# EAGLE design S202E (EAGLE 6.6.0)
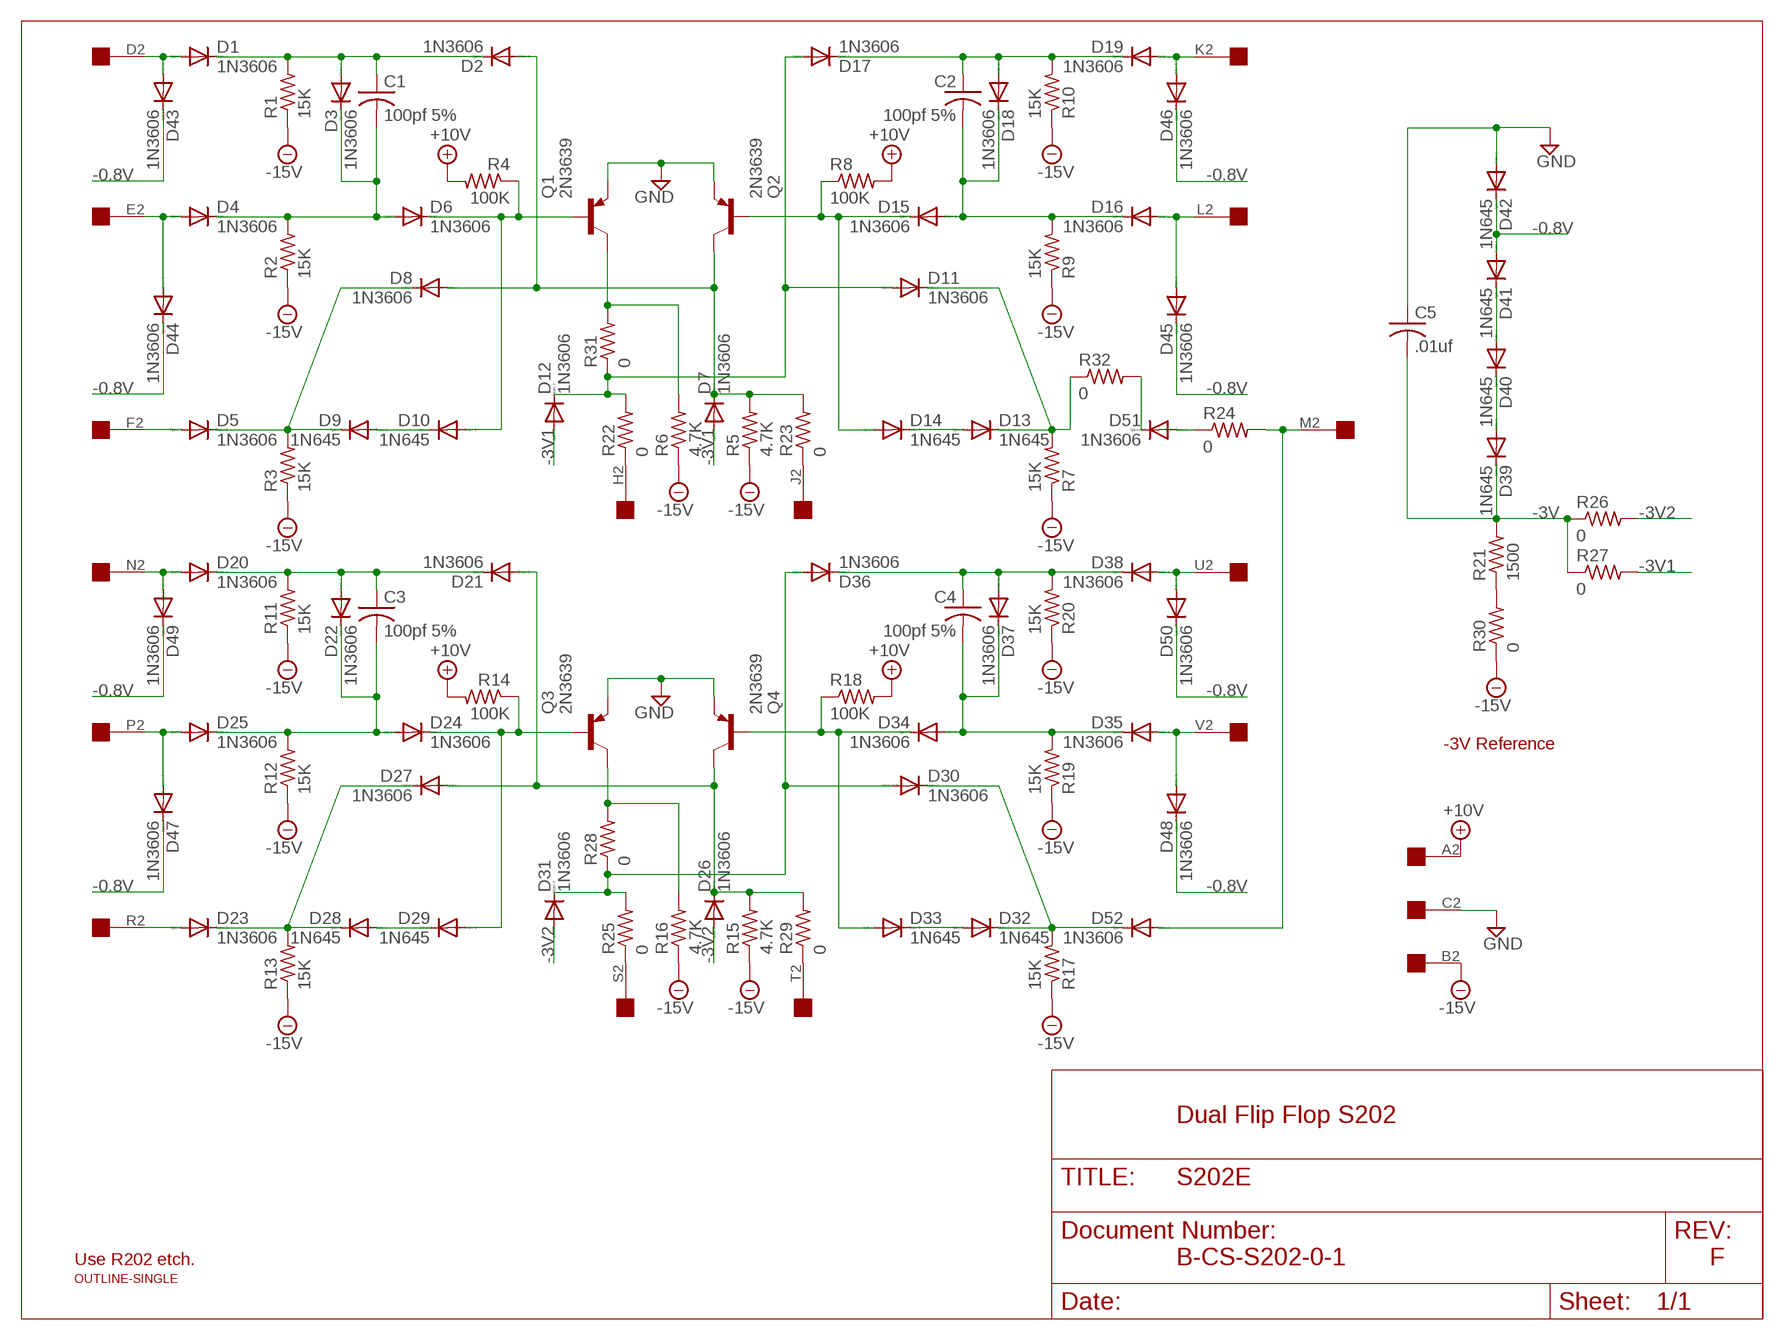
[diagram p0: schematic, sheet 1]

## Parts
C1  100pf 5%  C-US  [C063-025X075]
C2  100pf 5%  C-US  [C063-025X075]
C3  100pf 5%  C-US  [C063-025X075]
C4  100pf 5%  C-US  [C063-025X075]
C5  .01uf  C-US  [C063-025X075]
D1  1N3606  1N4148DO35-10  [DO35-10]
D2  1N3606  1N4148DO35-10  [DO35-10]
D3  1N3606  1N4148DO35-10  [DO35-10]
D4  1N3606  1N4148DO35-10  [DO35-10]
D5  1N3606  1N4148DO35-10  [DO35-10]
D6  1N3606  1N4148DO35-10  [DO35-10]
D7  1N3606  1N4148DO35-10  [DO35-10]
D8  1N3606  1N4148DO35-10  [DO35-10]
D9  1N645  1N4148DO35-10  [DO35-10]
D10  1N645  1N4148DO35-10  [DO35-10]
D11  1N3606  1N4148DO35-10  [DO35-10]
D12  1N3606  1N4148DO35-10  [DO35-10]
D13  1N645  1N4148DO35-10  [DO35-10]
D14  1N645  1N4148DO35-10  [DO35-10]
D15  1N3606  1N4148DO35-10  [DO35-10]
D16  1N3606  1N4148DO35-10  [DO35-10]
D17  1N3606  1N4148DO35-10  [DO35-10]
D18  1N3606  1N4148DO35-10  [DO35-10]
D19  1N3606  1N4148DO35-10  [DO35-10]
D20  1N3606  1N4148DO35-10  [DO35-10]
D21  1N3606  1N4148DO35-10  [DO35-10]
D22  1N3606  1N4148DO35-10  [DO35-10]
D23  1N3606  1N4148DO35-10  [DO35-10]
D24  1N3606  1N4148DO35-10  [DO35-10]
D25  1N3606  1N4148DO35-10  [DO35-10]
D26  1N3606  1N4148DO35-10  [DO35-10]
D27  1N3606  1N4148DO35-10  [DO35-10]
D28  1N645  1N4148DO35-10  [DO35-10]
D29  1N645  1N4148DO35-10  [DO35-10]
D30  1N3606  1N4148DO35-10  [DO35-10]
D31  1N3606  1N4148DO35-10  [DO35-10]
D32  1N645  1N4148DO35-10  [DO35-10]
D33  1N645  1N4148DO35-10  [DO35-10]
D34  1N3606  1N4148DO35-10  [DO35-10]
D35  1N3606  1N4148DO35-10  [DO35-10]
D36  1N3606  1N4148DO35-10  [DO35-10]
D37  1N3606  1N4148DO35-10  [DO35-10]
D38  1N3606  1N4148DO35-10  [DO35-10]
D39  1N645  1N4148DO35-10  [DO35-10]
D40  1N645  1N4148DO35-10  [DO35-10]
D41  1N645  1N4148DO35-10  [DO35-10]
D42  1N645  1N4148DO35-10  [DO35-10]
D43  1N3606  1N4148DO35-10  [DO35-10]
D44  1N3606  1N4148DO35-10  [DO35-10]
D45  1N3606  1N4148DO35-10  [DO35-10]
D46  1N3606  1N4148DO35-10  [DO35-10]
D47  1N3606  1N4148DO35-10  [DO35-10]
D48  1N3606  1N4148DO35-10  [DO35-10]
D49  1N3606  1N4148DO35-10  [DO35-10]
D50  1N3606  1N4148DO35-10  [DO35-10]
D51  1N3606  1N4148DO35-10  [DO35-10]
D52  1N3606  1N4148DO35-10  [DO35-10]
Q1  2N3639  2N3637  [TO39]
Q2  2N3639  2N3637  [TO39]
Q3  2N3639  2N3637  [TO39]
Q4  2N3639  2N3637  [TO39]
R1  15K  R-US_0207/10  [0207/10]
R2  15K  R-US_0207/10  [0207/10]
R3  15K  R-US_0207/10  [0207/10]
R4  100K  R-US_0207/10  [0207/10]
R5  4.7K  R-US_0207/10  [0207/10]
R6  4.7K  R-US_0207/10  [0207/10]
R7  15K  R-US_0207/10  [0207/10]
R8  100K  R-US_0207/10  [0207/10]
R9  15K  R-US_0207/10  [0207/10]
R10  15K  R-US_0207/10  [0207/10]
R11  15K  R-US_0207/10  [0207/10]
R12  15K  R-US_0207/10  [0207/10]
R13  15K  R-US_0207/10  [0207/10]
R14  100K  R-US_0207/10  [0207/10]
R15  4.7K  R-US_0207/10  [0207/10]
R16  4.7K  R-US_0207/10  [0207/10]
R17  15K  R-US_0207/10  [0207/10]
R18  100K  R-US_0207/10  [0207/10]
R19  15K  R-US_0207/10  [0207/10]
R20  15K  R-US_0207/10  [0207/10]
R21  1500  R-US_0207/10  [0207/10]
R22  0  R-US_0207/10  [0207/10]
R23  0  R-US_0207/10  [0207/10]
R24  0  R-US_0207/10  [0207/10]
R25  0  R-US_0207/10  [0207/10]
R26  0  R-US_0207/10  [0207/10]
R27  0  R-US_0207/10  [0207/10]
R28  0  R-US_0207/10  [0207/10]
R29  0  R-US_0207/10  [0207/10]
R30  0  R-US_0207/10  [0207/10]
R31  0  R-US_0207/10  [0207/10]
R32  0  R-US_0207/10  [0207/10]
U$1  OUTLINE-SINGLE  [SINGLE]
U$2  EDGE-1  [EDGE-CON1]

## Nets
+10V [Power]: R4.2 R8.2 R14.2 R18.2 U$2.A2
-0.8V: D41.A D42.C D43.C D44.C D45.C D46.C D47.C D48.C D49.C D50.C
-3V [Power]: C5.2 D39.C R21.2 R26.1 R27.1
-3V1: D7.A D12.A R27.2
-3V2: D26.A D31.A R26.2
-15V [Power]: R1.1 R2.1 R3.1 R5.1 R6.1 R7.1 R9.1 R10.1 R11.1 R12.1 R13.1 R15.1 R16.1 R17.1 R19.1 R20.1 R30.1 U$2.B2
GND [Power]: C5.1 D42.A Q1.1(E) Q2.1(E) Q3.1(E) Q4.1(E) U$2.C2
H: D11.A D12.C D17.A R22.2 R31.1
J: D2.A D7.C D8.A Q2.3(C) R5.2 R23.2
N$1: Q3.3(C) R16.2 R28.2
N$2: C2.1 D17.C D18.A D19.C R10.2
N$3: C1.2 D3.C D4.C D6.A R2.2
N$4: D1.A D43.A U$2.D2
N$5: D4.A D44.A U$2.E2
N$6: D13.A D14.C
N$7: D19.A D46.A U$2.K2
N$8: C2.2 D15.A D16.C D18.C R9.2
N$9: D5.C D8.C D9.C R3.2
N$10: D5.A U$2.F2
N$11: D16.A D45.A U$2.L2
N$12: D11.C D13.C R7.2 R32.1
N$13: D40.A D41.C
N$14: D6.C D10.A Q1.2(B) R4.1
N$15: D52.A R24.2 U$2.M2
N$16: D39.A D40.C
N$17: D14.A D15.C Q2.2(B) R8.1
N$18: C3.1 D20.C D21.C D22.A R11.2
N$19: D28.A D29.C
N$20: D20.A D49.A U$2.N2
N$21: C3.2 D22.C D24.A D25.C R12.2
N$22: C1.1 D1.C D2.C D3.A R1.2
N$23: D9.A D10.C
N$24: D25.A D47.A U$2.P2
N$25: D23.C D27.C D28.C R13.2
N$26: D23.A U$2.R2
N$27: D24.C D29.A Q3.2(B) R14.1
N$28: C4.1 D36.C D37.A D38.C R20.2
N$29: D32.A D33.C
N$30: D38.A D50.A U$2.U2
N$31: C4.2 D34.A D35.C D37.C R19.2
N$32: D35.A D48.A U$2.V2
N$33: R22.1 U$2.H2
N$34: D33.A D34.C Q4.2(B) R18.1
N$35: D30.C D32.C D52.C R17.2
N$36: R23.1 U$2.J2
N$37: D51.A R24.1
N$38: R25.1 U$2.S2
N$39: R29.1 U$2.T2
N$40 [Power]: R21.1 R30.2
N$41: Q1.3(C) R6.2 R31.2
N$42: D51.C R32.2
S: D30.A D31.C D36.A R25.2 R28.1
T: D21.A D26.C D27.A Q4.3(C) R15.2 R29.2

## Notes on the sheet
- -3V Reference
- Dual Flip Flop S202
- Use R202 etch. | B-CS-S202-0-1 | F

## Library data of the parts
C1-C5 = dec-con:C-US: Capacitors with funky DEC lead spacing.
D1-D52 = diode:1N4148: DIODE high speed (Philips)
Q1-Q4 = transistor-pnp:2N3637*: PNP Transistror
R1-R32 = rcl:R-US_: RESISTOR, American symbol
U$1 = dec-con:OUTLINE-*: Board outlines for DEC boards.
U$2 = dec-con:EDGE-1: Single-Sided DEC Edge Connector -- (side 2)

## Net classes
1 Power: width 0.813 mm

## Board
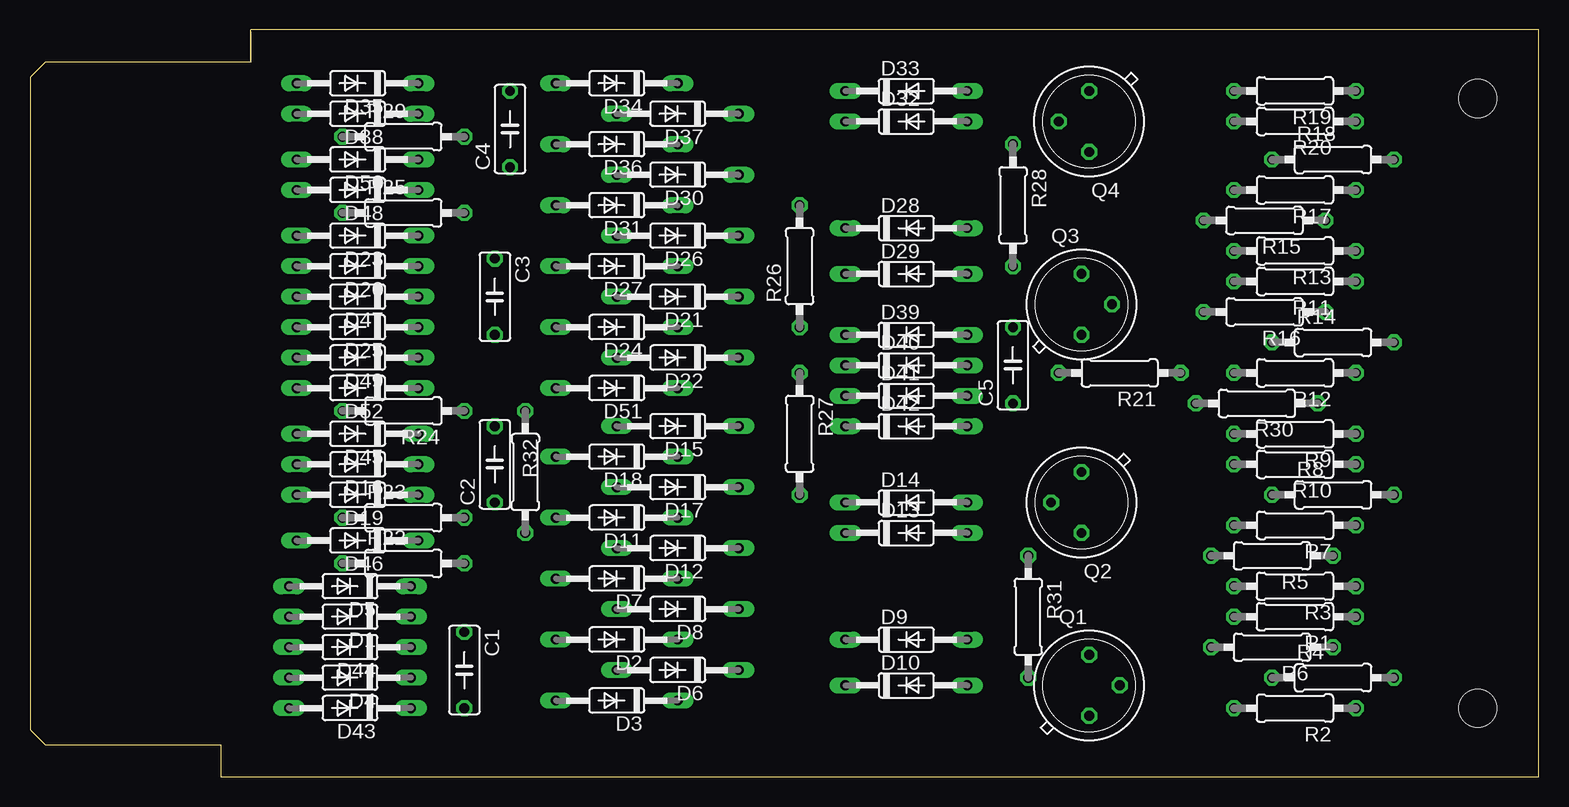
[diagram p1: board, top side]
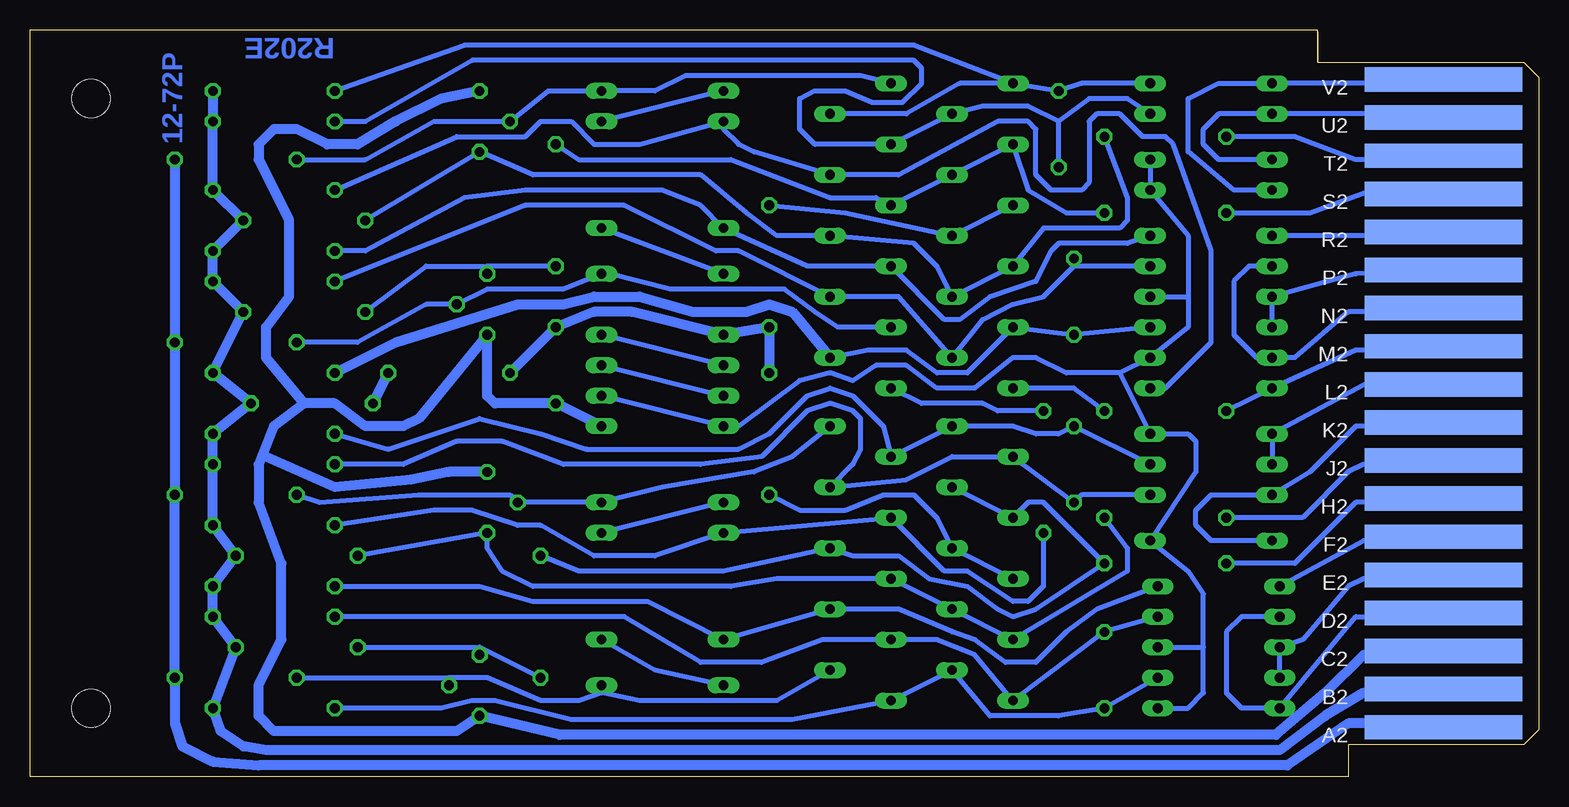
[diagram p2: board, bottom side, seen from below]

Size 125.73 x 62.23 mm. Coordinates in mm from the lower left corner, seen from the top.
Copper layers (1+16): Top 0.035mm / dielectric 1.5mm / Bottom 0.035mm
Design rules "16mils": minimum track width 16mil, minimum drill 32mil, track to track 15mil, track to pad 10mil, pad to pad 10mil, via to via 10mil, smd to smd 10mil, copper to edge 13mil, drill to drill 10mil, minimum pad ring 10mil, minimum via ring 8mil, stop-mask expansion 0mil, vias tented up to drill 0mil, thermal gap 10mil

### Footprints (pad centres in the part's own frame; a part is rotated, then mirrored left to right if it is on the bottom)
C063-025X075 = drill 0.813 octagon: 1 -2.54,0; 2 3.81,0
DO35-10 = drill 0.813 long: A 5.08,0; C -5.08,0
TO39 = drill 0.813 octagon: 1 0,-2.54; 2 2.54,0; 3 0,2.54
0207/10 = drill 0.813 octagon: 1 -5.08,0; 2 5.08,0
SINGLE = hole 3.175: 120.65,56.515; 120.65,5.715
EDGE-CON1 = smd 13.106 x 2.032 bottom: A2 7.938,4.128; B2 7.938,7.303; C2 7.938,10.477; D2 7.938,13.652; E2 7.938,16.828; F2 7.938,20.003; H2 7.938,23.177; J2 7.938,26.352; K2 7.938,29.527; L2 7.938,32.703; M2 7.938,35.877; N2 7.938,39.053; P2 7.938,42.227; R2 7.938,45.403; S2 7.938,48.578; T2 7.938,51.752; U2 7.938,54.928; V2 7.938,58.102

### Placement (x,y rotation side)
C1  36.2,9.53 270 top
C2  38.74,25.4 90 top
C3  38.74,40.64 270 top
C4  40.01,53.34 90 top
C5  81.92,33.66 90 top
D1  26.67,13.34 180 top
D2  48.9,11.43 180 top
D3  48.9,6.35 180 top
D4  26.67,8.26 180 top
D5  26.67,15.88 180 top
D6  53.98,8.89 180 top
D7  48.9,16.51 180 top
D8  53.98,13.97 180 top
D9  73.03,11.43 0 top
D10  73.03,7.62 0 top
D11  48.9,21.59 180 top
D12  53.98,19.05 180 top
D13  73.03,20.32 0 top
D14  73.03,22.86 0 top
D15  53.98,29.21 180 top
D16  27.31,26.04 180 top
D17  53.98,24.13 180 top
D18  48.9,26.67 180 top
D19  27.31,23.5 180 top
D20  27.31,42.55 180 top
D21  53.98,40.01 180 top
D22  53.98,34.92 180 top
D23  27.31,45.09 180 top
D24  48.9,37.47 180 top
D25  27.31,37.47 180 top
D26  53.98,45.09 180 top
D27  48.9,42.55 180 top
D28  73.03,45.72 0 top
D29  73.03,41.91 0 top
D30  53.98,50.16 180 top
D31  48.9,47.62 180 top
D32  73.03,54.61 0 top
D33  73.03,57.15 0 top
D34  48.9,57.78 180 top
D35  27.31,57.78 180 top
D36  48.9,52.7 180 top
D37  53.98,55.24 180 top
D38  27.31,55.24 180 top
D39  73.03,36.83 0 top
D40  73.03,34.29 0 top
D41  73.03,31.75 0 top
D42  73.03,29.21 0 top
D43  26.67,5.71 180 top
D44  26.67,10.79 180 top
D45  27.31,28.57 180 top
D46  27.31,19.68 180 top
D47  27.31,40.01 180 top
D48  27.31,48.9 180 top
D49  27.31,34.92 180 top
D50  27.31,51.44 180 top
D51  48.9,32.38 180 top
D52  27.31,32.38 180 top
Q1  88.27,7.62 0 top
Q2  87.63,22.86 180 top
Q3  87.63,39.37 0 top
Q4  88.27,54.61 180 top
R1  105.41,13.34 180 top
R2  105.41,5.71 180 top
R3  105.41,15.88 180 top
R4  108.59,8.26 0 top
R5  103.51,18.41 180 top
R6  103.51,10.79 180 top
R7  105.41,20.95 180 top
R8  108.59,23.5 0 top
R9  105.41,28.57 180 top
R10  105.41,26.04 180 top
R11  105.41,41.27 180 top
R12  105.41,33.66 180 top
R13  105.41,43.81 180 top
R14  108.59,36.2 0 top
R15  102.87,46.35 180 top
R16  102.87,38.73 180 top
R17  105.41,48.9 180 top
R18  108.59,51.44 0 top
R19  105.41,57.15 180 top
R20  105.41,54.61 180 top
R21  90.81,33.66 180 top
R22  31.12,17.78 0 top
R23  31.12,21.59 0 top
R24  31.12,30.48 180 top
R25  31.12,46.99 0 top
R26  64.14,42.55 90 top
R27  64.14,28.57 270 top
R28  81.92,47.62 270 top
R29  31.12,53.34 0 top
R30  102.24,31.11 180 top
R31  83.19,13.34 270 top
R32  41.28,25.4 90 top
U$1  0,0 0 top
U$2  0,0 0 top

### Tracks (layer width: path | path; a pad name or v marks a point on that pad's centre or on a via)
+10V
  Bottom 0.813: R18.2 R14.2 R8.2 R4.2 113.67,4.45 113.03,2.54 110.49,1.27 106.68,0.95 20.96,0.95 15.88,4.45 8.89,4.45 U$2.A2
-0.8V
  Bottom 0.406: D43.C 29.21,5.71 27.94,6.99 27.94,10.79 | 27.94,10.79 27.94,15.24 29.21,17.14 D46.C 28.58,25.4 28.58,27.94 29.21,28.57 D45.C 34.93,33.66 | D44.C 27.94,10.79 | 34.93,33.66 D49.C 29.21,37.47 29.21,40.01 | 34.93,33.66 39.37,33.66 41.91,34.92 43.82,34.92 46.99,32.38 50.17,32.38 52.71,34.29 55.25,34.29 57.15,33.02 59.06,33.66 61.6,33.02 66.68,29.21 D42.C D41.A | D47.C 29.21,40.01 | 29.21,40.01 29.21,45.09 D48.C D50.C
-3V
  Bottom 0.813: R27.1 R26.1 D39.C 75.57,38.73 78.74,38.73 C5.2 R21.2
-3V1
  Bottom 0.406: R27.2 61.6,22.23 57.79,22.23 54.61,23.5 52.07,23.5 50.17,21.59 D12.A D7.A
-3V2
  Bottom 0.406: D31.A D26.A 57.79,46.99 R26.2
-15V
  Bottom 0.813: R19.1 R20.1 R17.1 R15.1 R13.1 R11.1 R16.1 R12.1 R30.1 R9.1 R10.1 R7.1 R5.1 R3.1 R1.1 R6.1 R2.1 109.86,3.81 107.95,2.54 106.05,2.22 21.59,2.22 17.78,5.08 14.61,6.99 8.89,6.99 U$2.B2
GND
  Bottom 0.813: D42.A C5.1 87,31.11 87.63,31.75 Q3.1 93.35,29.84 94.62,29.21 97.79,29.21 100.33,31.11 102.87,31.11 | 102.87,31.11 106.05,34.92 106.05,37.47 104.14,40.01 104.14,46.35 106.68,51.44 106.68,52.7 105.41,53.98 103.51,53.98 100.97,52.7 98.43,52.7 95.25,54.61 91.44,56.52 Q4.1 | U$2.C2 8.89,10.16 14.61,10.16 17.78,6.99 21.91,3.49 81.6,3.49 Q1.1 90.17,3.81 105.41,3.81 106.68,5.08 106.68,7.62 104.78,11.43 104.78,17.78 106.68,22.86 106.68,26.04 106.37,26.8 | 102.87,31.11 105.41,29.21 106.37,26.8 | Q2.1 90.81,25.4 93.98,24.77 100.33,24.13 106.37,26.8
H
  Bottom 0.406: D17.A D11.A 42.55,22.86 41.28,22.86 R22.2 41.91,13.97 43.82,13.34 45.09,13.97 47.63,15.88 50.8,16.51 53.34,18.41 57.15,18.41 D12.C 67.95,17.14 80.01,17.14 R31.1
J
  Bottom 0.406: R23.2 34.29,19.05 34.29,17.14 D2.A D8.A D7.C 63.5,16.51 67.31,15.88 83.82,15.88 86.36,17.14 87.63,19.05 Q2.3 R5.2
N$1
  Bottom 0.406: R28.2 87.63,42.55 | 87.63,42.55 Q3.3 | R16.2 92.71,42.55 87.63,42.55
N$2
  Bottom 0.406: D19.C 38.1,23.5 C2.1 D18.A 48.9,26.67 52.71,24.77 D17.C 57.15,26.04 56.52,27.3 56.52,29.84 57.15,30.48 59.06,31.11 60.96,30.48 64.77,26.67 69.85,26.04 81.28,26.04 86.36,27.94 90.17,27.94 94.62,26.04 R10.2
N$3
  Bottom 0.406: D4.C C1.2 40.01,5.08 45.72,5.08 D6.A D3.C 62.23,4.76 80.65,4.76 87,6.35 88.9,6.35 91.44,5.71 R2.2
N$4
  Bottom 0.406: U$2.D2 8.89,13.34 15.24,13.34 D43.A 24.77,5.71 26.04,6.99 26.04,12.06 24.77,13.34 D1.A
N$5
  Bottom 0.406: U$2.E2 8.26,16.51 14.61,16.51 15.88,15.88 19.69,11.43 D44.A D4.A
N$6
  Bottom 0.406: D14.C D13.A
N$7
  Bottom 0.406: U$2.K2 8.89,29.21 15.24,29.21 19.05,25.4 D19.A 27.31,23.5 28.58,22.23 28.58,20.95 27.31,19.68 D46.A
N$8
  Bottom 0.406: D16.C C2.2 40.01,28.57 41.91,28.57 43.82,29.21 D15.A D18.C 54.61,29.21 57.15,31.75 59.06,32.38 60.96,31.75 64.14,28.57 66.68,27.3 79.38,27.3 83.19,28.57 88.27,29.84 95.89,27.3 R9.2
N$9
  Bottom 0.406: D5.C 36.83,13.97 39.37,12.06 41.91,9.53 44.45,9.53 46.99,11.43 48.9,12.06 53.34,13.97 D8.C D9.C 74.3,14.61 83.82,14.61 88.27,15.88 R3.2
N$10
  Bottom 0.406: D5.A 14.61,19.68 8.26,19.68 U$2.F2
N$11
  Bottom 0.406: U$2.L2 8.89,33.02 13.97,33.02 D45.A D16.A
N$12
  Bottom 0.406: R32.1 41.28,15.88 42.55,14.61 43.82,14.61 47.63,17.14 49.53,17.14 D11.C D13.C 73.66,18.41 78.74,18.41 83.19,20.95 85.09,20.95 88.9,22.23 92.08,22.23 R7.2
N$13
  Bottom 0.406: D40.A D41.C
N$14
  Bottom 0.406: R4.1 90.81,8.26 | 90.81,8.26 Q1.2 | D10.A 78.11,6.99 | 78.11,6.99 80.01,6.35 83.19,6.35 87.63,8.26 90.81,8.26 | D6.C 63.5,6.35 74.93,6.35 78.11,6.99
N$15
  Bottom 0.406: U$2.M2 8.89,35.56 15.24,35.56 D52.A R24.2
N$16
  Bottom 0.406: D40.C D39.A
N$17
  Bottom 0.406: D15.C 62.23,26.67 65.41,25.4 73.03,24.13 D14.A Q2.2 85.73,23.5 93.35,23.5 101.6,22.86 R8.1
N$18
  Bottom 0.406: D20.C 38.74,42.55 | 38.74,42.55 C3.1 | 38.74,42.55 41.28,40.01 43.82,39.37 46.36,38.1 D22.A 53.34,40.01 D21.C 66.68,43.81 68.58,43.81 76.2,47.62 84.46,47.62 R11.2
N$19
  Bottom 0.406: D29.C D28.A
N$20
  Bottom 0.406: D20.A 24.13,42.55 25.4,41.27 25.4,36.83 23.5,34.92 D49.A 20.32,34.92 15.88,38.73 10.16,38.73 U$2.N2
N$21
  Bottom 0.406: D25.C C3.2 D24.A 47.63,33.66 50.17,33.66 52.71,35.56 55.88,35.56 D22.C
  Bottom 0.813: R12.2 95.25,36.2 85.09,39.37 81.28,39.37 78.74,40.01 74.93,40.01 70.49,38.73 66.04,38.73 64.14,39.37 62.23,38.73 D22.C
N$22
  Bottom 0.406: D1.C C1.1 D3.A 46.99,10.16 50.17,11.43 D2.C 59.69,11.43 64.77,9.53 69.85,9.53 76.2,13.34 R1.2
N$23
  Bottom 0.406: D10.C 73.66,8.89 D9.A
N$24
  Bottom 0.406: U$2.P2 15.24,41.91 D47.A D25.A
N$25
  Bottom 0.406: D23.C 34.29,44.45 40.01,44.45 40.64,43.81 41.91,41.27 45.72,40.01 48.26,38.1 49.53,38.1 D27.C 60.96,42.55 D28.C 69.85,47.62 73.03,48.9 84.46,48.9 89.54,48.26 97.79,43.81 R13.2
N$26
  Bottom 0.406: U$2.R2 8.89,45.09 D23.A
N$27
  Bottom 0.406: R14.1 98.43,36.2 92.71,39.37 Q3.2 87.63,40.64 81.28,40.64 D29.A 77.47,41.91 72.39,40.64 62.87,40.64 60.33,38.73 58.42,37.47 D24.C
N$28
  Bottom 0.406: C4.1 40.01,54.61 | D38.C 34.29,56.52 37.47,56.52 40.01,54.61 | 40.01,54.61 42.55,55.88 46.36,55.88 D37.A D36.C 60.33,52.7 61.6,53.98 61.6,56.52 60.33,57.15 57.79,57.15 55.56,56.2 53.02,56.2 51.44,57.78 51.44,59.05 52.07,59.69 88.9,59.69 97.79,54.61 R20.2
N$29
  Bottom 0.406: D33.C D32.A
N$30
  Bottom 0.406: U$2.U2 8.89,54.61 13.97,55.24 D38.A 26.67,55.24 27.94,53.98 27.94,52.7 26.67,51.44 D50.A
N$31
  Bottom 0.406: D35.C 38.1,57.78 C4.2 D34.A | D34.A 48.26,57.78 52.71,55.24 D37.C | D34.A 52.07,60.96 89.54,60.96 R19.2
N$32
  Bottom 0.406: U$2.V2 8.26,58.42 13.97,57.78 D35.A 26.67,57.78 29.21,56.52 29.21,52.07 25.4,48.9 D48.A
N$33
  Bottom 0.406: U$2.H2 8.89,22.86 15.24,22.86 20.32,17.78 R22.1
N$34
  Bottom 0.406: R18.1 97.79,51.44 92.08,54.61 Q4.2 82.55,57.15 D33.A 73.66,57.15 71.12,58.42 56.52,58.42 D34.C
N$35
  Bottom 0.406: R17.2 90.17,53.34 84.46,53.34 83.19,54.61 80.65,54.61 78.74,52.7 74.93,52.7 D32.C 67.95,53.98 66.68,52.7 65.41,52.07 D30.C 53.34,50.16 45.09,54.61 42.55,54.61 41.91,53.98 41.91,50.16 40.64,48.9 38.1,48.9 37.47,49.53 37.47,54.61 36.83,55.24 34.93,55.24 33.02,53.34 31.12,53.34 30.48,52.7 27.31,43.81 27.31,36.2 31.12,32.38 D52.C
N$36
  Bottom 0.406: U$2.J2 7.62,26.04 14.61,26.04 15.88,25.4 19.69,21.59 R23.1
N$37
  Bottom 0.406: R24.1 38.74,32.38 D51.A
N$38
  Bottom 0.406: R25.1 19.05,46.99 13.97,48.9 U$2.S2
N$39
  Bottom 0.406: U$2.T2 8.89,51.44 15.24,51.44 20.32,53.34 R29.1
N$40
  Bottom 0.813: R21.1 R30.2
N$41
  Bottom 0.406: R6.2 88.27,10.79 | 88.27,10.79 R31.2 | 88.27,10.79 Q1.3
N$42
  Bottom 0.406: R32.2 45.09,30.48 46.36,31.11 51.44,31.11 D51.C
S
  Bottom 0.406: R25.2 39.37,46.99 42.55,48.9 D36.A D30.A D31.C 55.25,48.26 59.06,48.26 67.31,51.44 80.01,51.44 R28.1
T
  Bottom 0.406: R15.2 Q4.3 83.82,50.16 69.85,50.16 66.04,46.99 63.5,45.09 D26.C 52.07,44.45 50.17,42.55 D21.A D27.A 41.28,45.72 34.93,45.72 34.29,46.35 34.29,48.26 R29.2

### Text on the board
Bottom: R202E | 12-72P